# EasyEDA schematic Arduino_Dimmer.json
TITLE: Digiata Dimmer for Fan, Wind Exhibit, Ebergy Exhebition 2024; REV: 0.0; Date: 2024-11-26; Sheet: 1/1; Company: Amir BS
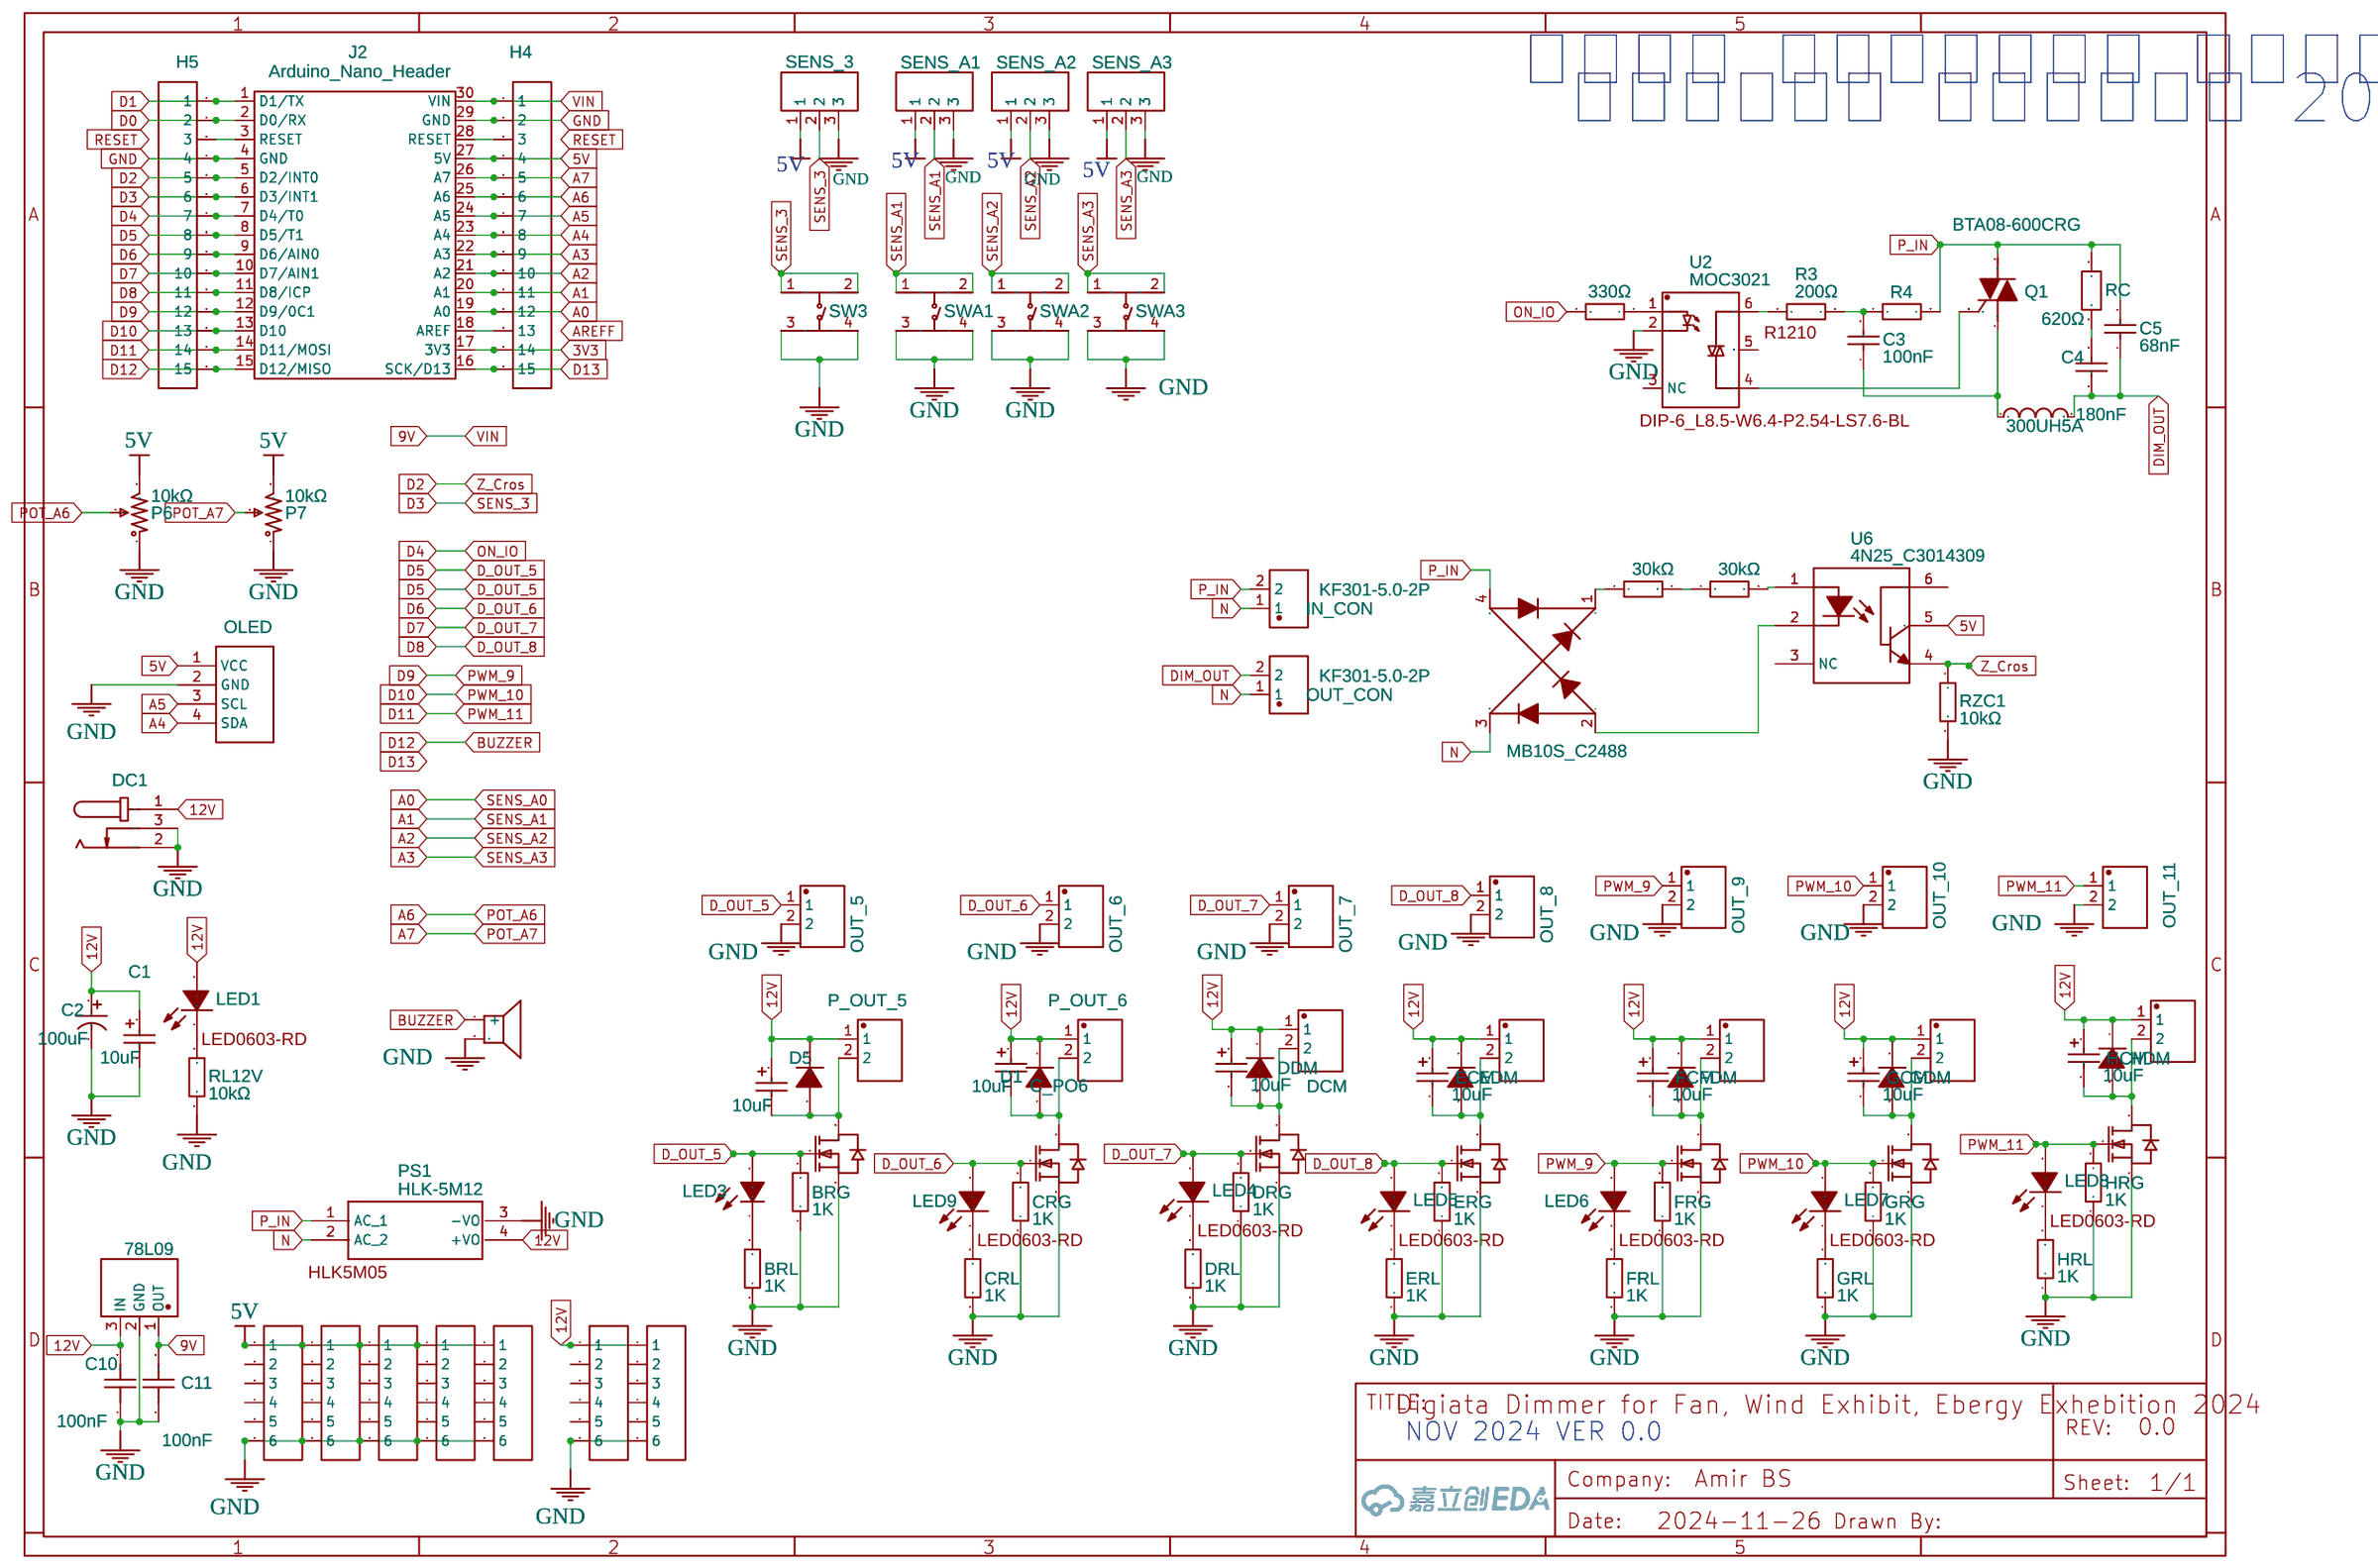
[diagram p0: schematic sheet]

## Parts
BQ  Q  [SOT-23-3_L2.9-W1.3-P0.95-LS2.4-BR]
BRG  1K  [R0603]
BRL  1K  [R0603]
BUZZER1  BUZZER-12X9  [BUZ-TH_BD12.0-P7.60-D0.6-FD]
C1  10uF  [CAP-SMD_L3.2-W1.6-RD-C7171]
C2  100uF  [CAP-TH_BD6.3-P2.50-D1.0-FD]
C3  100nF  [CAP-TH_L13.0-W6.0-P10.00-D0.6]
C4  180nF  [CAP-TH_L13.0-W6.0-P10.00-D1.2]
C5  68nF  [CAP-TH_L13.0-W6.0-P10.00-D1.2]
C10  100nF  [C0603]
C11  100nF  [C0603]
C_PO5  10uF  [CAP-SMD_L3.2-W1.6-RD-C7171]
C_PO6  10uF  [CAP-SMD_L3.2-W1.6-RD-C7171]
CQ  Q  [SOT-23-3_L2.9-W1.3-P0.95-LS2.4-BR]
CRG  1K  [R0603]
CRL  1K  [R0603]
D1  M7_C95872  [SMA_L4.3-W2.6-LS5.2-RD]
D2  MB10S_C2488  [MBS_L4.7-W3.8-P2.40-LS7.0-TL]
D5  M7_C95872  [SMA_L4.3-W2.6-LS5.2-RD]
DC1  DC  [DC-IN-TH_DC005]
DCM  10uF  [CAP-SMD_L3.2-W1.6-RD-C7171]
DCON  KF2510-2A  [CONN-TH_KF2510-2A]
DDM  1N4007  [SMAF_L3.5-W2.6-LS4.7-RD]
DQ  Q  [SOT-23-3_L2.9-W1.3-P0.95-LS2.4-BR]
DRG  1K  [R0603]
DRL  1K  [R0603]
ECM  10uF  [CAP-SMD_L3.2-W1.6-RD-C7171]
ECON  KF2510-2A  [CONN-TH_KF2510-2A]
EDM  1N4007  [SMAF_L3.5-W2.6-LS4.7-RD]
EQ  Q  [SOT-23-3_L2.9-W1.3-P0.95-LS2.4-BR]
ERG  1K  [R0603]
ERL  1K  [R0603]
FCM  10uF  [CAP-SMD_L3.2-W1.6-RD-C7171]
FCON  KF2510-2A  [CONN-TH_KF2510-2A]
FDM  1N4007  [SMAF_L3.5-W2.6-LS4.7-RD]
FQ  Q  [SOT-23-3_L2.9-W1.3-P0.95-LS2.4-BR]
FRG  1K  [R0603]
FRL  1K  [R0603]
GCM  10uF  [CAP-SMD_L3.2-W1.6-RD-C7171]
GCON  KF2510-2A  [CONN-TH_KF2510-2A]
GDM  1N4007  [SMAF_L3.5-W2.6-LS4.7-RD]
GQ  Q  [SOT-23-3_L2.9-W1.3-P0.95-LS2.4-BR]
GRG  1K  [R0603]
GRL  1K  [R0603]
H1  HDR-F-2.54_1x6  [HDR-F-2.54_1X6]
H2  HDR-F-2.54_1x6  [HDR-F-2.54_1X6]
H3  HDR-F-2.54_1x6  [HDR-F-2.54_1X6]
H4  HDR-F-2.54_1x15  [HDR-F-2.54_1X15]
H5  HDR-F-2.54_1x15  [HDR-F-2.54_1X15]
H6  HDR-F-2.54_1x6  [HDR-F-2.54_1X6]
H7  HDR-F-2.54_1x6  [HDR-F-2.54_1X6]
H8  HDR-F-2.54_1x6  [HDR-F-2.54_1X6]
H11  HDR-F-2.54_1x6  [HDR-F-2.54_1X6]
HCM  10uF  [CAP-SMD_L3.2-W1.6-RD-C7171]
HCON  KF2510-2A  [CONN-TH_KF2510-2A]
HDM  1N4007  [SMAF_L3.5-W2.6-LS4.7-RD]
HQ  Q  [SOT-23-3_L2.9-W1.3-P0.95-LS2.4-BR]
HRG  1K  [R0603]
HRL  1K  [R0603]
IN_CON  KF301-5.0-2P  [CONN-TH_P5.00_KF301-5.0-2P]
J2  Arduino_Nano_Header  [DIP-30_L43.18-W15.24-ARDUINONANO]
LED1  KT-0603R  [LED0603-RD]
LED3  19-213/Y2C-CQ2R2L/3T(CY)  [LED0603-RD-YELLOW]
LED4  KT-0603R  [LED0603-RD]
LED5  KT-0603R  [LED0603-RD]
LED6  KT-0603R  [LED0603-RD]
LED7  KT-0603R  [LED0603-RD]
LED8  KT-0603R  [LED0603-RD]
LED9  KT-0603R  [LED0603-RD]
OLED  1.3 inch OLED SSH1106 I2C 128x64 copy  [1.3_OLED_SSH1106_I2C_128X64_BOARD]
OUT_5  KF2510-2A  [CONN-TH_KF2510-2A]
OUT_6  KF2510-2A  [CONN-TH_KF2510-2A]
OUT_7  KF2510-2A  [CONN-TH_KF2510-2A]
OUT_8  KF2510-2A  [CONN-TH_KF2510-2A]
OUT_9  KF2510-2A  [CONN-TH_KF2510-2A]
OUT_10  KF2510-2A  [CONN-TH_KF2510-2A]
OUT_11  KF2510-2A  [CONN-TH_KF2510-2A]
OUT_CON  KF301-5.0-2P  [CONN-TH_P5.00_KF301-5.0-2P]
P6  10kΩ  [RES-ADJ-TH_3P-L10.0-W10.0-P2.50-L]
P7  10kΩ  [RES-ADJ-TH_3P-L10.0-W10.0-P2.50-L]
P_OUT_5  KF2510-2A  [CONN-TH_KF2510-2A]
P_OUT_6  KF2510-2A  [CONN-TH_KF2510-2A]
PS1  HLK-5M12  [HLK5M05]
Q1  BTA08-600CRG  [TO-220-3_L10.0-W4.5-P2.54-L]
R1  30kΩ  [R1812]
R2  30kΩ  [R1812]
R3  200Ω  [R1210]
R4  680Ω  [R1210]
RC  620Ω  [R2512]
RL12V  10kΩ  [R0603]
RONW  330Ω  [R0603]
RZC1  10kΩ  [R0603]
SENS_3  FK2510  [CONN-TH_3P-P2.00_KF2510_3A]
SENS_A1  FK2510  [CONN-TH_3P-P2.00_KF2510_3A]
SENS_A2  FK2510  [CONN-TH_3P-P2.00_KF2510_3A]
SENS_A3  FK2510  [CONN-TH_3P-P2.00_KF2510_3A]
SW3  TC-6610-7-160G  [SW-TH_4P-L5.0-W5.0-P4.50-LS6.5]
SWA1  TC-6610-7-160G  [SW-TH_4P-L5.0-W5.0-P4.50-LS6.5]
SWA2  TC-6610-7-160G  [SW-TH_4P-L5.0-W5.0-P4.50-LS6.5]
SWA3  TC-6610-7-160G  [SW-TH_4P-L5.0-W5.0-P4.50-LS6.5]
U2  MOC3021  [DIP-6_L8.5-W6.4-P2.54-LS7.6-BL]
U3  300UH5A  [IND-TH_BD26.0-P10.80_300UH5A]
U5  78L09  [SOT-89-3_L4.5-W2.5-P1.50-LS4.0-BR]
U6  4N25_C3014309  [DIP-6_L7.3-W6.5-P2.54-LS7.6-BL]

## Library data of the parts
BQ CQ DQ EQ FQ GQ HQ = JSM2302: Supplier: LCSC; Supplier Part: C5224189; Manufacturer: ElecSuper(静芯微）; Manufacturer Part: AO3400; Contributor: LCSC; JLCPCB Part Class: Extended Part; Package Display: No
BRG BRL CRG CRL DRG DRL ERG ERL FRG FRL GRG GRL HRG HRL = 0603WAF1001T5E: Supplier: LCSC; Manufacturer: UniOhm; Supplier Part: C21190; JLCPCB Part Class: Basic Part; Package Display: No
BUZZER1 = BUZZER-12X9: Contributor: lcsc; Supplier: LCSC; Supplier Part: C9900016920; Manufacturer: null; JLCPCB Part Class: Extended Part; Package Display: No
C1 = TAJA106K016RNJ: Supplier: LCSC; Manufacturer: Kyocera AVX; Supplier Part: C7171; JLCPCB Part Class: Basic Part; Package Display: No
C2 = 100uF 35V 6.3*11: Supplier: LCSC; Manufacturer: CX(承兴); Supplier Part: C19504; JLCPCB Part Class: Extended Part; Package Display: No
C3 = MP2104KGC3RLC: Supplier: LCSC; Manufacturer: SRD(圣融达); Supplier Part: C93370; JLCPCB Part Class: Extended Part; Package Display: No
C4 = MPP184J4130610LC: Supplier: LCSC; Manufacturer: SRD(圣融达); Supplier Part: C109611; JLCPCB Part Class: Extended Part; Package Display: No
C5 = MPP683J4130509LC: Supplier: LCSC; Manufacturer: SRD(圣融达); Supplier Part: C93252; JLCPCB Part Class: Extended Part; Package Display: No
C10 C11 = CC0603KRX7R9BB104: JLCPCB Part Class: Basic Part; Package Display: No
C_PO5 C_PO6 DCM ECM FCM GCM HCM = TAJA106K016RNJ: JLCPCB Part Class: Basic Part; Package Display: No
D1 D5 = M7_C95872: Supplier: LCSC; Manufacturer: MDD; Supplier Part: C95872; JLCPCB Part Class: Basic Part; Package Display: No
D2 = MB10S_C2488: Supplier: LCSC; Manufacturer: MDD(辰达半导体); Supplier Part: C2488; JLCPCB Part Class: Basic Part; Package Display: No
DC1 = DC005-2.0MM: Supplier: LCSC; Manufacturer: SOFNG; Supplier Part: C111567; Package Display: No
DCON ECON FCON GCON HCON OUT_5-OUT_11 P_OUT_5 P_OUT_6 = KF2510-2A: Supplier: LCSC; Manufacturer: BOOMELE; Supplier Part: C27543; JLCPCB Part Class: Extended Part; Package Display: No
DDM EDM FDM GDM HDM = 1N4007F: Supplier: LCSC; Manufacturer: SK; Supplier Part: C110856; JLCPCB Part Class: Extended Part; Package Display: No
H1-H3 H6-H8 H11 = HDR-F-2.54_1x6: Supplier Part: C40877; Supplier: LCSC; Contributor: LCEDA_Lib; Package Display: No
H4 H5 = HDR-F-2.54_1x15: Supplier Part: C124408; Supplier: LCSC; Contributor: LCEDA_Lib; Package Display: No
IN_CON OUT_CON = KF301-5.0-2P: Contributor: LCSC; Supplier: LCSC; Supplier Part: C474881; Manufacturer: KEFA(科发); JLCPCB Part Class: Extended Part; Package Display: No
J2 = Arduino_Nano_Header
LED1 LED4-LED9 = KT-0603R: Supplier: LCSC; Manufacturer: KENTO; Supplier Part: C2286; JLCPCB Part Class: Basic Part; Package Display: Yes
LED3 = 19-213/Y2C-CQ2R2L/3T(CY): Supplier: LCSC; Manufacturer: EVERLIGHT(亿光); Supplier Part: C72038; JLCPCB Part Class: Basic Part; Package Display: No
OLED = 1.3 inch OLED SSH1106 I2C 128x64 copy: Contributor: Deguello; Package Display: No
P6 P7 = 3296W-1-103: Resistance(Ohms): 10K; Contributor: LCSC; JLCPCB Part Class: Extended Part; Package Display: No
PS1 = HLK-5M05: Contributor: rctutu; Package Display: Yes
Q1 = BTA08-600CRG: Supplier: LCSC; Manufacturer: ST(意法半导体); Supplier Part: C9102; JLCPCB Part Class: Extended Part; Package Display: No
R1 R2 = 1812W2J0303T4E: Contributor: LCSC; Supplier: LCSC; Supplier Part: C109214; Manufacturer: UNI-ROYAL(厚声); JLCPCB Part Class: Extended Part; Package Display: No
R3 = RTT122000FTP: Supplier: LCSC; Manufacturer: RALEC(旺诠); Supplier Part: C104979; JLCPCB Part Class: Extended Part; Package Display: Yes
R4 = RMC12106805%N: Contributor: LCSC; Supplier: LCSC; Supplier Part: C269643; Manufacturer: Tyohm(幸亚电阻); JLCPCB Part Class: Extended Part; Package Display: No
RC = 25121WJ0621T4E: Contributor: LCSC; Supplier: LCSC; Supplier Part: C474165; Manufacturer: UNI-ROYAL(厚声); JLCPCB Part Class: Extended Part; Package Display: No
RL12V RZC1 = 0603WAF1002T5E: Supplier: LCSC; Manufacturer: UNI-ROYAL(厚声); Supplier Part: C25804; Resistance (Ohms): 10K; JLCPCB Part Class: Basic Part; Package Display: No
RONW = 0603WAF3300T5E: Supplier: LCSC; Manufacturer: UNI-ROYAL(厚声); Supplier Part: C23138; JLCPCB Part Class: Basic Part; Package Display: No
SENS_3 SENS_A1-SENS_A3 = kf2510_3A: JLCPCB Part Class: Extended Part; Package Display: No
SW3 SWA1-SWA3 = TC-6610-7-160G: Contributor: LCSC; Supplier: LCSC; Supplier Part: C2845252; Manufacturer: HCTL(华灿天禄); JLCPCB Part Class: Extended Part; Package Display: No
U2 = MOC3021: Contributor: LCSC; Supplier: LCSC; Supplier Part: C123202; Manufacturer: LITEON(光宝); JLCPCB Part Class: Extended Part; Package Display: Yes
U3 = 300UH5A: Contributor: LCSC; Supplier: LCSC; Supplier Part: C9900011335; Manufacturer: null; JLCPCB Part Class: Extended Part; Package Display: No
U5 = 78L09U 78L09: Contributor: LCSC; Supplier: LCSC; Supplier Part: C2875177; Manufacturer: CBI(创基); JLCPCB Part Class: Extended Part; Package Display: No
U6 = 4N25_C3014309: Contributor: lcsc; Supplier: LCSC; Supplier Part: C3014309; Manufacturer: UMW(友台半导体); JLCPCB Part Class: Extended Part; Package Display: No

## Nets
3V3: H4.14 J2.17(3V3)
5V: H1.1 H2.1 H3.1 H4.4 H7.1 H8.1 J2.27(5V) OLED.1(VCC) P6.3 P7.3 SENS_3.1 SENS_A1.1 SENS_A2.1 SENS_A3.1 U6.5
9V: C11.2 H4.1 J2.30(VIN) U5.1(OUT)
12V: C1.1 C2.1 C10.2 C_PO5.1 C_PO6.1 D1.1(K) D5.1(K) DC1.1 DCM.1 DCON.1 DDM.1(C) ECM.1 ECON.1 EDM.1(C) FCM.1 FCON.1 FDM.1(C) GCM.1 GCON.1 GDM.1(C) H6.1 H11.1 HCM.1 HCON.1 HDM.1(C) LED1.2(A) P_OUT_5.1 P_OUT_6.1 PS1.4(+VO) U5.3(IN)
GND: BQ.2(S) BRG.1 BRL.1 BUZZER1.2 C1.2 C2.2 C10.1 C11.1 CQ.2(S) CRG.1 CRL.1 DC1.2 DC1.3 DQ.2(S) DRG.1 DRL.1 EQ.2(S) ERG.1 ERL.1 FQ.2(S) FRG.1 FRL.1 GQ.2(S) GRG.1 GRL.1 H1.6 H2.6 H3.6 H4.2 H5.4 H6.6 H7.6 H8.6 H11.6 HQ.2(S) HRG.1 HRL.1 J2.4(GND) J2.29(GND) OLED.2(GND) OUT_5.2 OUT_6.2 OUT_7.2 OUT_8.2 OUT_9.2 OUT_10.2 OUT_11.2 P6.1 P7.1 PS1.3(-VO) RL12V.2 RZC1.2 SENS_3.3 SENS_A1.3 SENS_A2.3 SENS_A3.3 SW3.3 SW3.4 SWA1.3 SWA1.4 SWA2.3 SWA2.4 SWA3.3 SWA3.4 U2.2 U5.2(GND)
A0: H4.12 J2.19(A0)
A1: H4.11 J2.20(A1) SENS_A1.2 SWA1.1 SWA1.2
A2: H4.10 J2.21(A2) SENS_A2.2 SWA2.1 SWA2.2
A3: H4.9 J2.22(A3) SENS_A3.2 SWA3.1 SWA3.2
A4: H4.8 J2.23(A4) OLED.4(SDA)
A5: H4.7 J2.24(A5) OLED.3(SCL)
A6: H4.6 J2.25(A6) P6.2
A7: H4.5 J2.26(A7) P7.2
BUZZER: BUZZER1.1(+) H5.15 J2.15(D12/MISO)
D0: H5.2 J2.2(D0/RX)
D1: H5.1 J2.1(D1/TX)
D2: H5.5 J2.5(D2/INT0) RZC1.1 U6.4
D3: H5.6 J2.6(D3/INT1) SENS_3.2 SW3.1 SW3.2
D4: H5.7 J2.7(D4/T0) RONW.2
D5: BQ.1(G) BRG.2 H5.8 J2.8(D5/T1) LED3.2(A) OUT_5.1
D6: CQ.1(G) CRG.2 H5.9 J2.9(D6/AIN0) LED9.2(A) OUT_6.1
D7: DQ.1(G) DRG.2 H5.10 J2.10(D7/AIN1) LED4.2(A) OUT_7.1
D8: EQ.1(G) ERG.2 H5.11 J2.11(D8/ICP) LED5.2(A) OUT_8.1
D9: FQ.1(G) FRG.2 H5.12 J2.12(D9/0C1) LED6.2(A) OUT_9.1
D10: GQ.1(G) GRG.2 H5.13 J2.13(D10) LED7.2(A) OUT_10.1
D11: H5.14 HQ.1(G) HRG.2 J2.14(D11/MOSI) LED8.2(A) OUT_11.1
D13: H4.15 J2.16(SCK/D13)
DIM_OUT: C4.1 C5.1 OUT_CON.2 U3.2
N: D2.3(C2) IN_CON.1 OUT_CON.1 PS1.2(AC)
P_IN: C5.2 D2.4(C1) IN_CON.2 PS1.1(AC) Q1.2(M2) R4.2 RC.2
Net-(BQ-3): BQ.3(D) C_PO5.2 D5.2(A) P_OUT_5.2
Net-(BRL-2): BRL.2 LED3.1(C)
Net-(C3-1): C3.1 Q1.1(M1) U3.1
Net-(C3-2): C3.2 R3.2 R4.1
Net-(C4-2): C4.2 RC.1
Net-(C_PO6-2): C_PO6.2 CQ.3(D) D1.2(A) P_OUT_6.2
Net-(CRL-2): CRL.2 LED9.1(K)
Net-(D2-1): D2.1(+) R1.1
Net-(D2-2): D2.2(-) U6.2
Net-(DCM-2): DCM.2 DCON.2 DDM.2(A) DQ.3(D)
Net-(DRL-2): DRL.2 LED4.1(K)
Net-(ECM-2): ECM.2 ECON.2 EDM.2(A) EQ.3(D)
Net-(ERL-2): ERL.2 LED5.1(K)
Net-(FCM-2): FCM.2 FCON.2 FDM.2(A) FQ.3(D)
Net-(FRL-2): FRL.2 LED6.1(K)
Net-(GCM-2): GCM.2 GCON.2 GDM.2(A) GQ.3(D)
Net-(GRL-2): GRL.2 LED7.1(K)
Net-(H4-3): H4.3 J2.28(RESET)
Net-(H4-13): H4.13 J2.18(AREF)
Net-(H5-3): H5.3 J2.3(RESET)
Net-(HCM-2): HCM.2 HCON.2 HDM.2(A) HQ.3(D)
Net-(HRL-2): HRL.2 LED8.1(K)
Net-(LED1-1): LED1.1(K) RL12V.1
Net-(Q1-3): Q1.3(G) U2.4(E)
Net-(R1-2): R1.2 R2.1
Net-(R2-2): R2.2 U6.1
Net-(R3-1): R3.1 U2.6(BASE)
Net-(RONW-1): RONW.1 U2.1

Not connected (* = marked no-connect by the designer): H1 2 3 4 5; H2 2 3 4 5; H3 2 3 4 5; H6 2 3 4 5; H7 2 3 4 5; H8 2 3 4 5; H11 2 3 4 5; U2 3(NC) 5(SUB); U6 3(NC) 6

## Notes on the sheet
- דימר דיגיטלי להפעלת מפוח
- תערוכת אנרגיה 2024
- NOV 2024 VER 0.0
